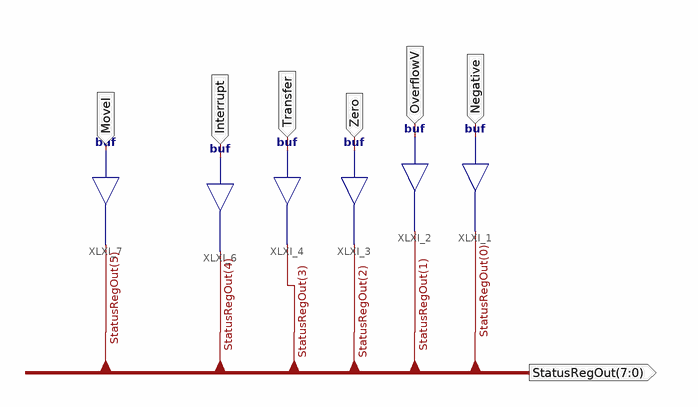
[diagram p0: schematic sheet 1]
// Xilinx ISE schematic StatusRegWriter.sch (spartan3e) as structural Verilog: 6 symbols, 7 ports
module StatusRegWriter (
  input  Negative,
  input  OverflowV,
  input  Zero,
  input  Transfer,
  input  MoveI,
  input  Interrupt,
  output [7:0] StatusRegOut
);

  buf XLXI_1 (StatusRegOut[0], Negative);
  buf XLXI_2 (StatusRegOut[1], OverflowV);
  buf XLXI_3 (StatusRegOut[2], Zero);
  buf XLXI_4 (StatusRegOut[3], Transfer);
  buf XLXI_6 (StatusRegOut[4], Interrupt);
  buf XLXI_7 (StatusRegOut[5], MoveI);
endmodule
